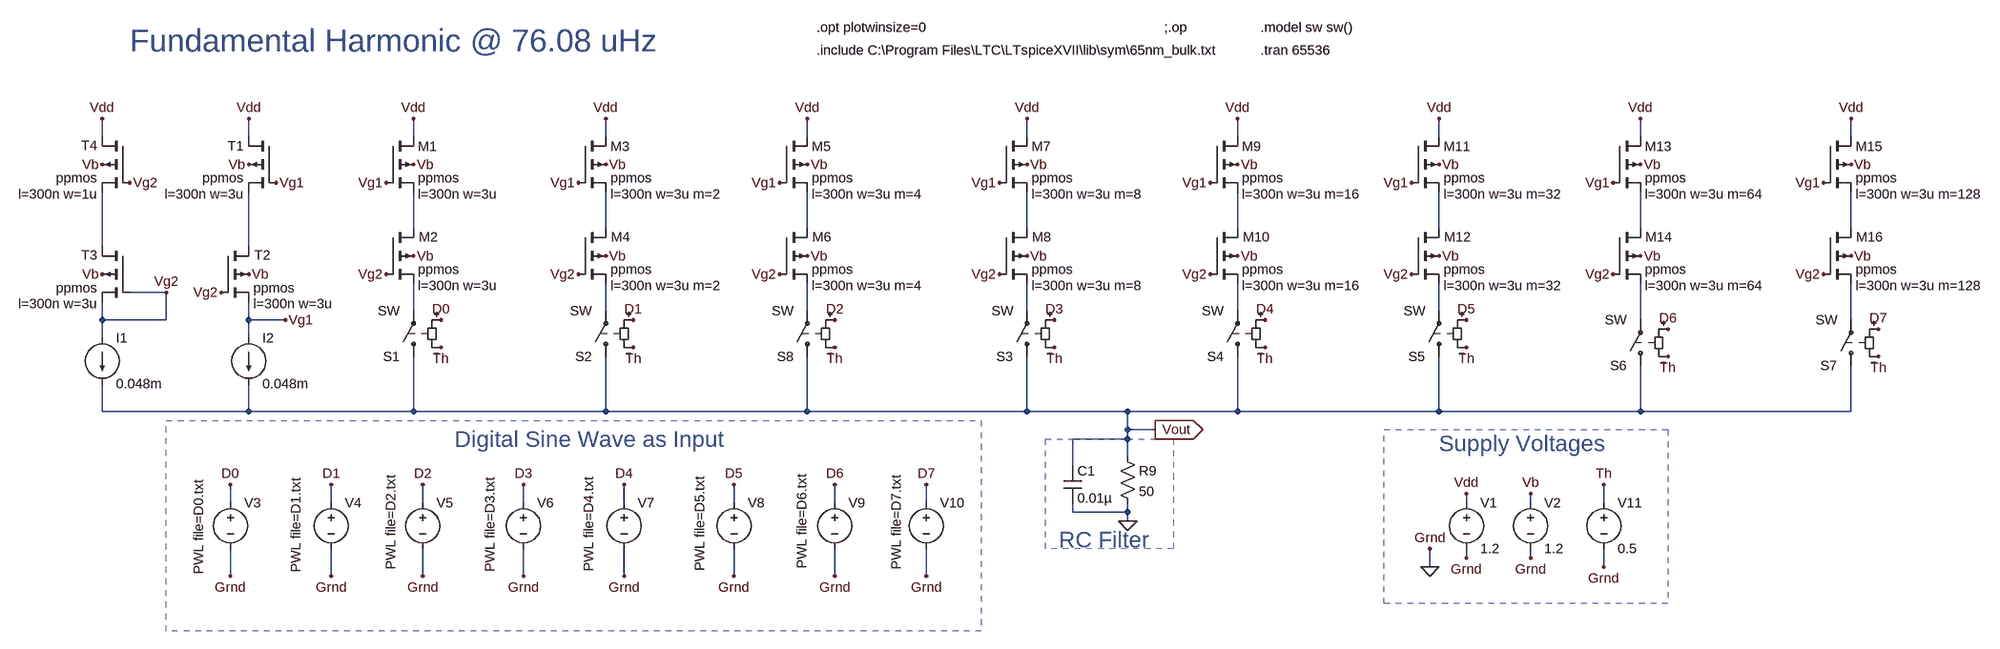
[diagram p0: schematic Sine Wave With DAC.asc]
Sine Wave With DAC.asc, the LTspice schematic file:
Version 4
SHEET 1 1748 776
WIRE -1568 -368 -1568 -400
WIRE -1312 -368 -1312 -400
WIRE -1024 -368 -1024 -400
WIRE -688 -368 -688 -400
WIRE -336 -368 -336 -400
WIRE 48 -368 48 -400
WIRE 416 -368 416 -400
WIRE 768 -368 768 -400
WIRE 1120 -368 1120 -400
WIRE 1488 -368 1488 -400
WIRE -1024 -208 -1024 -272
WIRE -688 -208 -688 -272
WIRE -336 -208 -336 -272
WIRE 48 -208 48 -272
WIRE 416 -208 416 -272
WIRE 768 -208 768 -272
WIRE 1120 -208 1120 -272
WIRE 1488 -208 1488 -272
WIRE -1568 -176 -1568 -272
WIRE -1312 -176 -1312 -272
WIRE -1456 -96 -1520 -96
WIRE -1024 -64 -1024 -112
WIRE -688 -64 -688 -112
WIRE -336 -64 -336 -112
WIRE 48 -64 48 -112
WIRE 416 -64 416 -112
WIRE 768 -64 768 -112
WIRE -1568 -48 -1568 -80
WIRE -1456 -48 -1456 -96
WIRE -1456 -48 -1568 -48
WIRE -1312 -48 -1312 -80
WIRE -1248 -48 -1312 -48
WIRE 1120 -48 1120 -112
WIRE 1488 -48 1488 -112
WIRE -1568 -16 -1568 -48
WIRE -1312 -16 -1312 -48
WIRE -1568 112 -1568 64
WIRE -1312 112 -1312 64
WIRE -1312 112 -1568 112
WIRE -1024 112 -1024 16
WIRE -1024 112 -1312 112
WIRE -688 112 -688 16
WIRE -688 112 -1024 112
WIRE -336 112 -336 16
WIRE -336 112 -688 112
WIRE 48 112 48 16
WIRE 48 112 -336 112
WIRE 224 112 48 112
WIRE 416 112 416 16
WIRE 416 112 224 112
WIRE 768 112 768 16
WIRE 768 112 416 112
WIRE 1120 112 1120 32
WIRE 1120 112 768 112
WIRE 1488 112 1488 32
WIRE 1488 112 1120 112
WIRE 224 144 224 112
WIRE 272 144 224 144
WIRE 224 160 224 144
WIRE 224 160 128 160
WIRE 224 192 224 160
WIRE 128 208 128 160
WIRE -1344 272 -1344 240
WIRE -1168 272 -1168 240
WIRE -1008 272 -1008 240
WIRE -832 272 -832 240
WIRE -656 272 -656 240
WIRE -464 272 -464 240
WIRE -288 272 -288 240
WIRE -128 272 -128 240
WIRE 816 272 816 256
WIRE 928 272 928 256
WIRE 1056 272 1056 240
WIRE 128 288 128 272
WIRE 224 288 224 272
WIRE 224 288 128 288
WIRE 224 304 224 288
WIRE 816 368 816 352
WIRE 928 368 928 352
WIRE 752 384 752 352
WIRE 1056 384 1056 352
WIRE -1344 400 -1344 352
WIRE -1168 400 -1168 352
WIRE -1008 400 -1008 352
WIRE -832 400 -832 352
WIRE -656 400 -656 352
WIRE -464 400 -464 352
WIRE -288 400 -288 352
WIRE -128 400 -128 352
FLAG -1568 -128 Vb
FLAG -1312 -128 Vb
FLAG -1568 -320 Vb
FLAG -1312 -320 Vb
FLAG -1312 -400 Vdd
FLAG -1568 -400 Vdd
FLAG -1520 -288 Vg2
FLAG -1456 -96 Vg2
FLAG -1264 -288 Vg1
FLAG -1248 -48 Vg1
FLAG -1024 -160 Vb
FLAG -1024 -320 Vb
FLAG -1024 -400 Vdd
FLAG -1072 -288 Vg1
FLAG -1072 -128 Vg2
FLAG -1360 -96 Vg2
FLAG -688 -160 Vb
FLAG -688 -320 Vb
FLAG -688 -400 Vdd
FLAG -736 -288 Vg1
FLAG -736 -128 Vg2
FLAG -336 -160 Vb
FLAG -336 -320 Vb
FLAG -336 -400 Vdd
FLAG -384 -288 Vg1
FLAG -384 -128 Vg2
FLAG 48 -160 Vb
FLAG 48 -320 Vb
FLAG 48 -400 Vdd
FLAG 0 -288 Vg1
FLAG 0 -128 Vg2
FLAG 416 -160 Vb
FLAG 416 -320 Vb
FLAG 416 -400 Vdd
FLAG 368 -288 Vg1
FLAG 368 -128 Vg2
FLAG 768 -160 Vb
FLAG 768 -320 Vb
FLAG 768 -400 Vdd
FLAG 720 -288 Vg1
FLAG 720 -128 Vg2
FLAG 1120 -160 Vb
FLAG 1120 -320 Vb
FLAG 1120 -400 Vdd
FLAG 1072 -288 Vg1
FLAG 1072 -128 Vg2
FLAG 1488 -160 Vb
FLAG 1488 -320 Vb
FLAG 1488 -400 Vdd
FLAG 1440 -288 Vg1
FLAG 1440 -128 Vg2
FLAG 752 384 0
FLAG 752 352 Grnd
FLAG 816 368 Grnd
FLAG 928 368 Grnd
FLAG 928 256 Vb
FLAG 816 256 Vdd
FLAG -1168 400 Grnd
FLAG -1008 400 Grnd
FLAG -832 400 Grnd
FLAG -656 400 Grnd
FLAG -464 400 Grnd
FLAG -288 400 Grnd
FLAG -128 400 Grnd
FLAG -1344 400 Grnd
FLAG -1344 240 D0
FLAG -1168 240 D1
FLAG -1008 240 D2
FLAG -832 240 D3
FLAG -656 240 D4
FLAG -464 240 D5
FLAG -288 240 D6
FLAG -128 240 D7
FLAG -976 -48 D0
FLAG -640 -48 D1
FLAG -288 -48 D2
FLAG 96 -48 D3
FLAG 464 -48 D4
FLAG 816 -48 D5
FLAG 1168 -32 D6
FLAG 1536 -32 D7
FLAG 224 304 0
FLAG 272 144 Vout
IOPIN 272 144 Out
FLAG 1056 384 Grnd
FLAG 1056 240 Th
FLAG -976 0 Th
FLAG -640 0 Th
FLAG -288 0 Th
FLAG 96 0 Th
FLAG 464 0 Th
FLAG 816 0 Th
FLAG 1168 16 Th
FLAG 1536 16 Th
SYMBOL pmos4 -1264 -368 M0
WINDOW 0 56 16 Left 2
WINDOW 123 56 100 Left 2
SYMATTR InstName T1
SYMATTR Value2 l=300n w=3u
SYMATTR Value ppmos
SYMBOL pmos4 -1360 -176 R0
WINDOW 0 58 15 Left 2
WINDOW 123 56 100 Left 2
SYMATTR InstName T2
SYMATTR Value2 l=300n w=3u
SYMATTR Value ppmos
SYMBOL pmos4 -1520 -176 M0
WINDOW 0 56 15 Left 2
WINDOW 123 56 100 Left 2
SYMATTR InstName T3
SYMATTR Value2 l=300n w=3u
SYMATTR Value ppmos
SYMBOL current -1568 -16 R0
WINDOW 123 0 0 Left 0
WINDOW 39 0 0 Left 0
SYMATTR InstName I1
SYMATTR Value 0.048m
SYMBOL current -1312 -16 R0
WINDOW 123 0 0 Left 0
WINDOW 39 0 0 Left 0
SYMATTR InstName I2
SYMATTR Value 0.048m
SYMBOL pmos4 -1520 -368 M0
WINDOW 0 56 15 Left 2
WINDOW 123 56 100 Left 2
SYMATTR InstName T4
SYMATTR Value2 l=300n w=1u
SYMATTR Value ppmos
SYMBOL pmos4 -1072 -368 R0
WINDOW 0 56 17 Left 2
WINDOW 123 56 100 Left 2
SYMATTR InstName M1
SYMATTR Value2 l=300n w=3u
SYMATTR Value ppmos
SYMBOL pmos4 -1072 -208 R0
WINDOW 0 57 15 Left 2
WINDOW 123 56 100 Left 2
SYMATTR InstName M2
SYMATTR Value2 l=300n w=3u
SYMATTR Value ppmos
SYMBOL pmos4 -736 -368 R0
WINDOW 0 56 17 Left 2
WINDOW 123 56 100 Left 2
SYMATTR InstName M3
SYMATTR Value2 l=300n w=3u m=2
SYMATTR Value ppmos
SYMBOL pmos4 -736 -208 R0
WINDOW 0 57 15 Left 2
WINDOW 123 56 100 Left 2
SYMATTR InstName M4
SYMATTR Value2 l=300n w=3u m=2
SYMATTR Value ppmos
SYMBOL pmos4 -384 -368 R0
WINDOW 0 56 17 Left 2
WINDOW 123 56 100 Left 2
SYMATTR InstName M5
SYMATTR Value2 l=300n w=3u m=4
SYMATTR Value ppmos
SYMBOL pmos4 -384 -208 R0
WINDOW 0 57 15 Left 2
WINDOW 123 56 100 Left 2
SYMATTR InstName M6
SYMATTR Value2 l=300n w=3u m=4
SYMATTR Value ppmos
SYMBOL pmos4 0 -368 R0
WINDOW 0 56 17 Left 2
WINDOW 123 56 100 Left 2
SYMATTR InstName M7
SYMATTR Value2 l=300n w=3u m=8
SYMATTR Value ppmos
SYMBOL pmos4 0 -208 R0
WINDOW 0 57 15 Left 2
WINDOW 123 56 100 Left 2
SYMATTR InstName M8
SYMATTR Value2 l=300n w=3u m=8
SYMATTR Value ppmos
SYMBOL pmos4 368 -368 R0
WINDOW 0 56 17 Left 2
WINDOW 123 56 100 Left 2
SYMATTR InstName M9
SYMATTR Value2 l=300n w=3u m=16
SYMATTR Value ppmos
SYMBOL pmos4 368 -208 R0
WINDOW 0 57 15 Left 2
WINDOW 123 56 100 Left 2
SYMATTR InstName M10
SYMATTR Value2 l=300n w=3u m=16
SYMATTR Value ppmos
SYMBOL pmos4 720 -368 R0
WINDOW 0 56 17 Left 2
WINDOW 123 56 100 Left 2
SYMATTR InstName M11
SYMATTR Value2 l=300n w=3u m=32
SYMATTR Value ppmos
SYMBOL pmos4 720 -208 R0
WINDOW 0 57 15 Left 2
WINDOW 123 56 100 Left 2
SYMATTR InstName M12
SYMATTR Value2 l=300n w=3u m=32
SYMATTR Value ppmos
SYMBOL pmos4 1072 -368 R0
WINDOW 0 56 17 Left 2
WINDOW 123 56 100 Left 2
SYMATTR InstName M13
SYMATTR Value2 l=300n w=3u m=64
SYMATTR Value ppmos
SYMBOL pmos4 1072 -208 R0
WINDOW 0 57 15 Left 2
WINDOW 123 56 100 Left 2
SYMATTR InstName M14
SYMATTR Value2 l=300n w=3u m=64
SYMATTR Value ppmos
SYMBOL pmos4 1440 -368 R0
WINDOW 0 56 17 Left 2
WINDOW 123 56 100 Left 2
SYMATTR InstName M15
SYMATTR Value2 l=300n w=3u m=128
SYMATTR Value ppmos
SYMBOL pmos4 1440 -208 R0
WINDOW 0 57 15 Left 2
WINDOW 123 56 100 Left 2
SYMATTR InstName M16
SYMATTR Value2 l=300n w=3u m=128
SYMATTR Value ppmos
SYMBOL voltage 816 256 R0
WINDOW 123 0 0 Left 0
WINDOW 39 0 0 Left 0
SYMATTR InstName V1
SYMATTR Value 1.2
SYMBOL voltage 928 256 R0
WINDOW 123 0 0 Left 0
WINDOW 39 0 0 Left 0
SYMATTR InstName V2
SYMATTR Value 1.2
SYMBOL voltage -1344 256 R0
WINDOW 3 -55 -25 VRight 2
WINDOW 123 0 0 Left 0
WINDOW 39 0 0 Left 0
SYMATTR Value PWL file=D0.txt
SYMATTR InstName V3
SYMBOL voltage -1168 256 R0
WINDOW 3 -61 -28 VRight 2
WINDOW 123 0 0 Left 0
WINDOW 39 0 0 Left 0
SYMATTR Value PWL file=D1.txt
SYMATTR InstName V4
SYMBOL voltage -1008 256 R0
WINDOW 3 -55 -33 VRight 2
WINDOW 123 0 0 Left 0
WINDOW 39 0 0 Left 0
SYMATTR Value PWL file=D2.txt
SYMATTR InstName V5
SYMBOL voltage -832 256 R0
WINDOW 3 -58 -29 VRight 2
WINDOW 123 0 0 Left 0
WINDOW 39 0 0 Left 0
SYMATTR Value PWL file=D3.txt
SYMATTR InstName V6
SYMBOL voltage -656 256 R0
WINDOW 3 -61 -30 VRight 2
WINDOW 123 0 0 Left 0
WINDOW 39 0 0 Left 0
SYMATTR Value PWL file=D4.txt
SYMATTR InstName V7
SYMBOL voltage -464 256 R0
WINDOW 3 -59 -31 VRight 2
WINDOW 123 0 0 Left 0
WINDOW 39 0 0 Left 0
SYMATTR Value PWL file=D5.txt
SYMATTR InstName V8
SYMBOL voltage -288 256 R0
WINDOW 3 -57 -35 VRight 2
WINDOW 123 0 0 Left 0
WINDOW 39 0 0 Left 0
SYMATTR Value PWL file=D6.txt
SYMATTR InstName V9
SYMBOL voltage -128 256 R0
WINDOW 3 -52 -33 VRight 2
WINDOW 123 0 0 Left 0
WINDOW 39 0 0 Left 0
SYMATTR Value PWL file=D7.txt
SYMATTR InstName V10
SYMBOL sw -1024 32 R180
SYMATTR InstName S1
SYMBOL sw -688 32 R180
SYMATTR InstName S2
SYMBOL sw 48 32 R180
SYMATTR InstName S3
SYMBOL sw 416 32 R180
SYMATTR InstName S4
SYMBOL sw 768 32 R180
SYMATTR InstName S5
SYMBOL sw 1120 48 R180
SYMATTR InstName S6
SYMBOL sw 1488 48 R180
SYMATTR InstName S7
SYMBOL sw -336 32 R180
SYMATTR InstName S8
SYMBOL res 208 176 R0
SYMATTR InstName R9
SYMATTR Value 50
SYMBOL cap 112 208 R0
SYMATTR InstName C1
SYMATTR Value 0.01µ
SYMBOL voltage 1056 256 R0
WINDOW 123 0 0 Left 0
WINDOW 39 0 0 Left 0
SYMATTR InstName V11
SYMATTR Value 0.5
TEXT -320 -520 Left 2 !.include C:\\Program Files\\LTC\\LTspiceXVII\\lib\\sym\\65nm_bulk.txt
TEXT -320 -560 Left 2 !.opt plotwinsize=0
TEXT 288 -560 Left 2 !;.op
TEXT 456 -560 Left 2 !.model sw sw()
TEXT 456 -520 Left 2 !.tran 65536
TEXT 104 336 Left 4 ;RC Filter
TEXT 768 168 Left 4 ;Supply Voltages
TEXT -952 160 Left 4 ;Digital Sine Wave as Input
TEXT -1520 -536 Left 5 ;Fundamental Harmonic @ 76.08 uHz
RECTANGLE Normal 1168 448 672 144 2
RECTANGLE Normal -32 496 -1456 128 2
RECTANGLE Normal 304 352 80 160 2

The netlist it stands for:
* Sine Wave With DAC.asc
M§T1 Vdd Vg1 N010 Vb ppmos l=300n w=3u
M§T2 N010 Vg2 Vg1 Vb ppmos l=300n w=3u
M§T3 N009 Vg2 Vg2 Vb ppmos l=300n w=3u
I1 Vg2 Vout 0.048m
I2 Vg1 Vout 0.048m
M§T4 Vdd Vg2 N009 Vb ppmos l=300n w=1u
M1 Vdd Vg1 N001 Vb ppmos l=300n w=3u
M2 N001 Vg2 N011 Vb ppmos l=300n w=3u
M3 Vdd Vg1 N002 Vb ppmos l=300n w=3u m=2
M4 N002 Vg2 N012 Vb ppmos l=300n w=3u m=2
M5 Vdd Vg1 N003 Vb ppmos l=300n w=3u m=4
M6 N003 Vg2 N013 Vb ppmos l=300n w=3u m=4
M7 Vdd Vg1 N004 Vb ppmos l=300n w=3u m=8
M8 N004 Vg2 N014 Vb ppmos l=300n w=3u m=8
M9 Vdd Vg1 N005 Vb ppmos l=300n w=3u m=16
M10 N005 Vg2 N015 Vb ppmos l=300n w=3u m=16
M11 Vdd Vg1 N006 Vb ppmos l=300n w=3u m=32
M12 N006 Vg2 N016 Vb ppmos l=300n w=3u m=32
M13 Vdd Vg1 N007 Vb ppmos l=300n w=3u m=64
M14 N007 Vg2 N017 Vb ppmos l=300n w=3u m=64
M15 Vdd Vg1 N008 Vb ppmos l=300n w=3u m=128
M16 N008 Vg2 N018 Vb ppmos l=300n w=3u m=128
V1 Vdd 0 1.2
V2 Vb 0 1.2
V3 D0 0 PWL file=D0.txt
V4 D1 0 PWL file=D1.txt
V5 D2 0 PWL file=D2.txt
V6 D3 0 PWL file=D3.txt
V7 D4 0 PWL file=D4.txt
V8 D5 0 PWL file=D5.txt
V9 D6 0 PWL file=D6.txt
V10 D7 0 PWL file=D7.txt
S1 Vout N011 D0 Th SW
S2 Vout N012 D1 Th SW
S3 Vout N014 D3 Th SW
S4 Vout N015 D4 Th SW
S5 Vout N016 D5 Th SW
S6 Vout N017 D6 Th SW
S7 Vout N018 D7 Th SW
S8 Vout N013 D2 Th SW
R9 Vout 0 50
C1 Vout 0 0.01µ
V11 Th 0 0.5
.model NMOS NMOS
.model PMOS PMOS
.lib standard.mos
.include C:\Program Files\LTC\LTspiceXVII\lib\sym\65nm_bulk.txt
.opt plotwinsize=0
;.op
.model sw sw()
.tran 65536
* RC Filter
* Supply Voltages
* Digital Sine Wave as Input
* Fundamental Harmonic @ 76.08 uHz
.backanno
.end